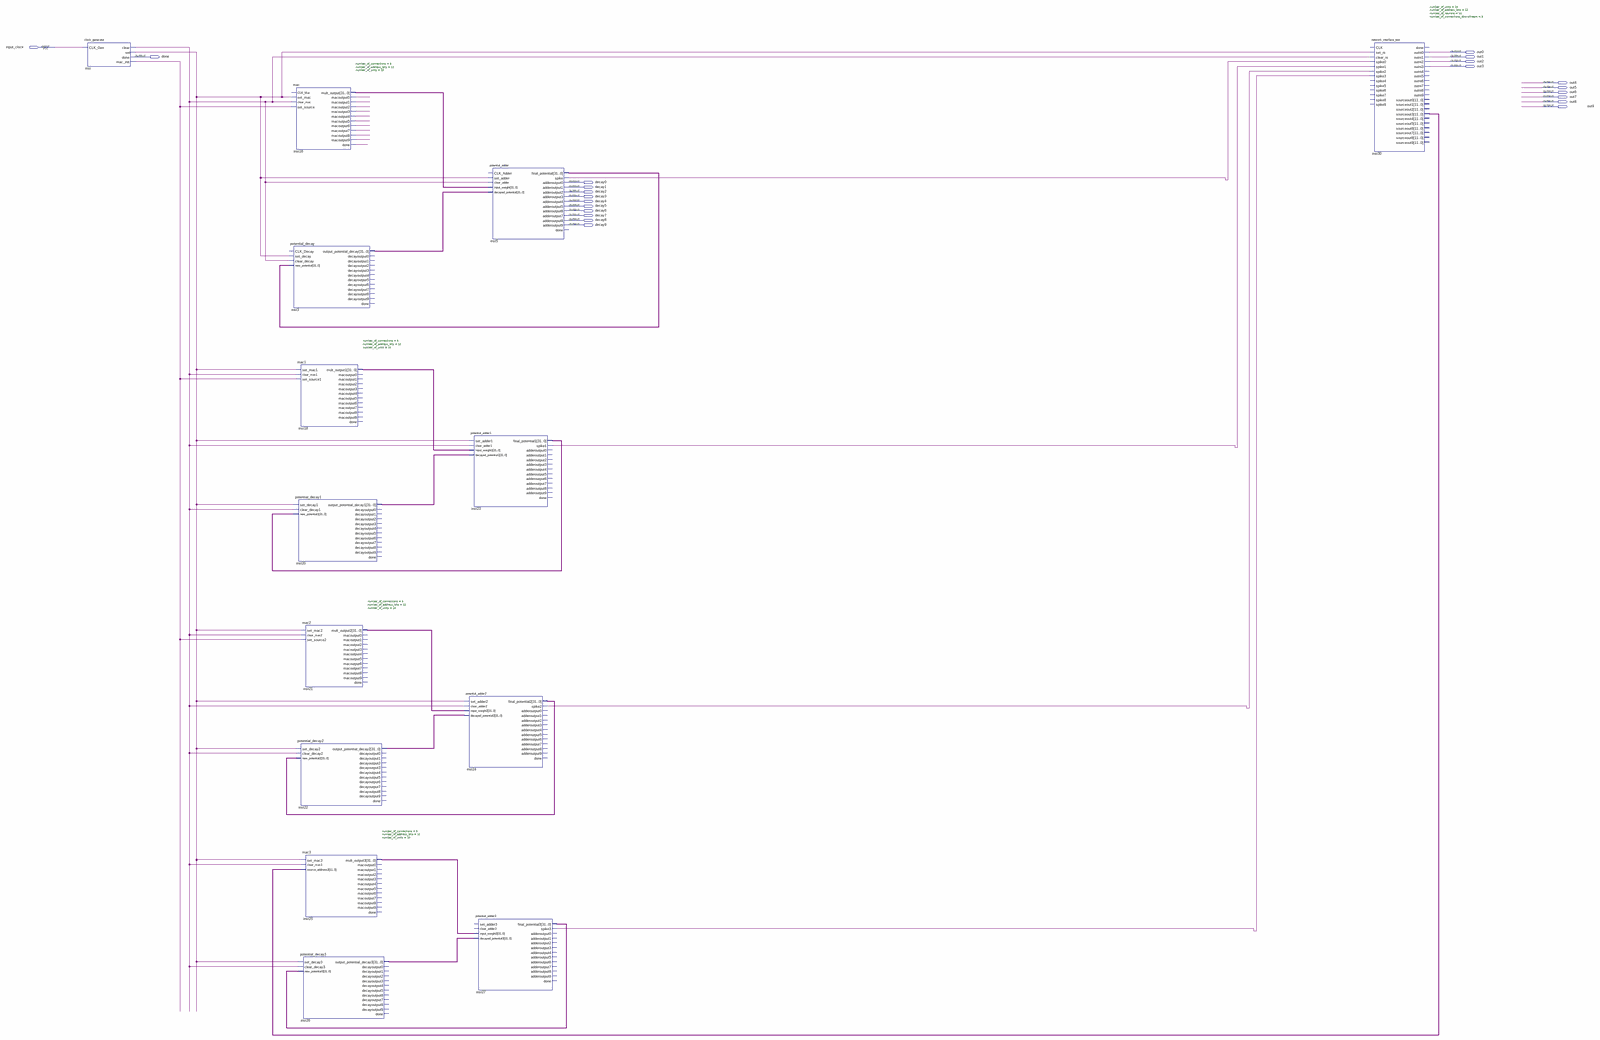
[diagram p0: schematic sheet, whole]
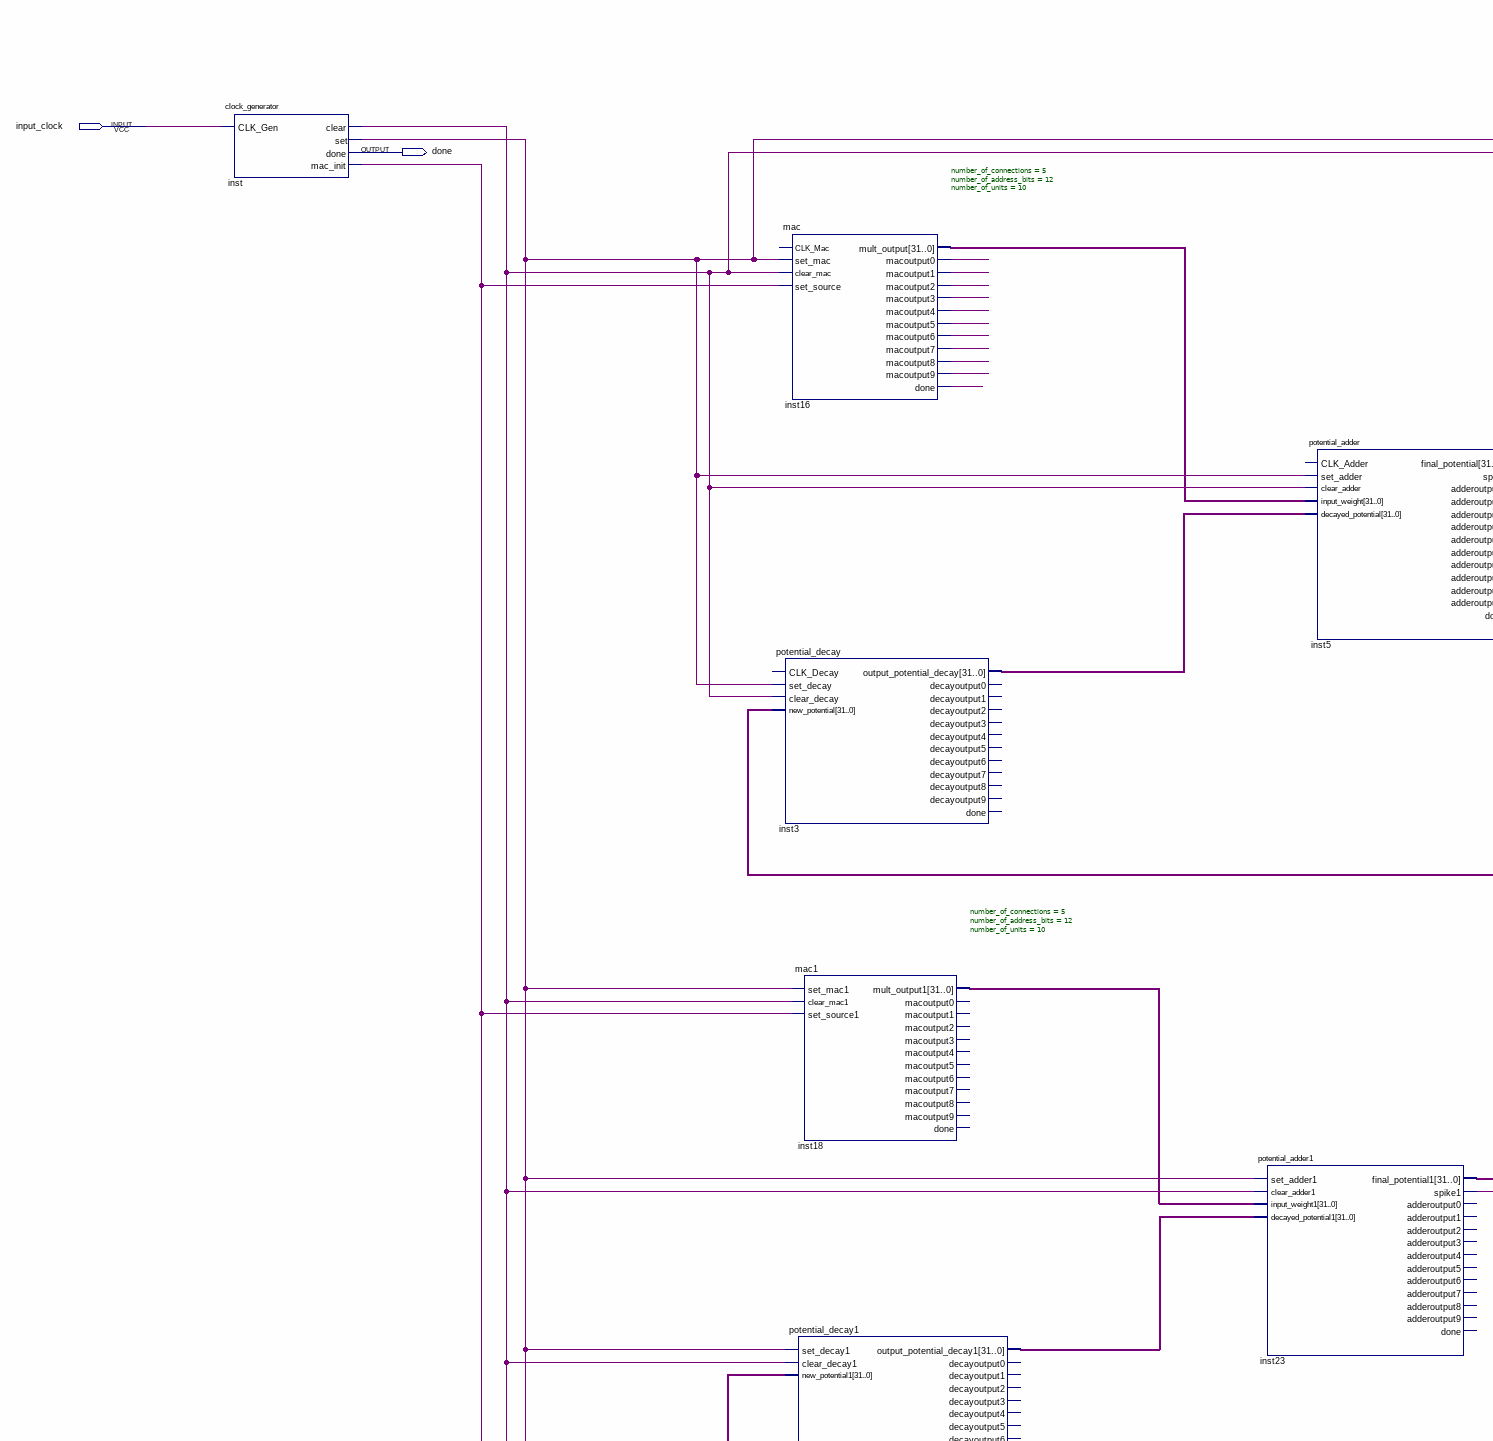
[diagram p1: schematic sheet, upper left part]
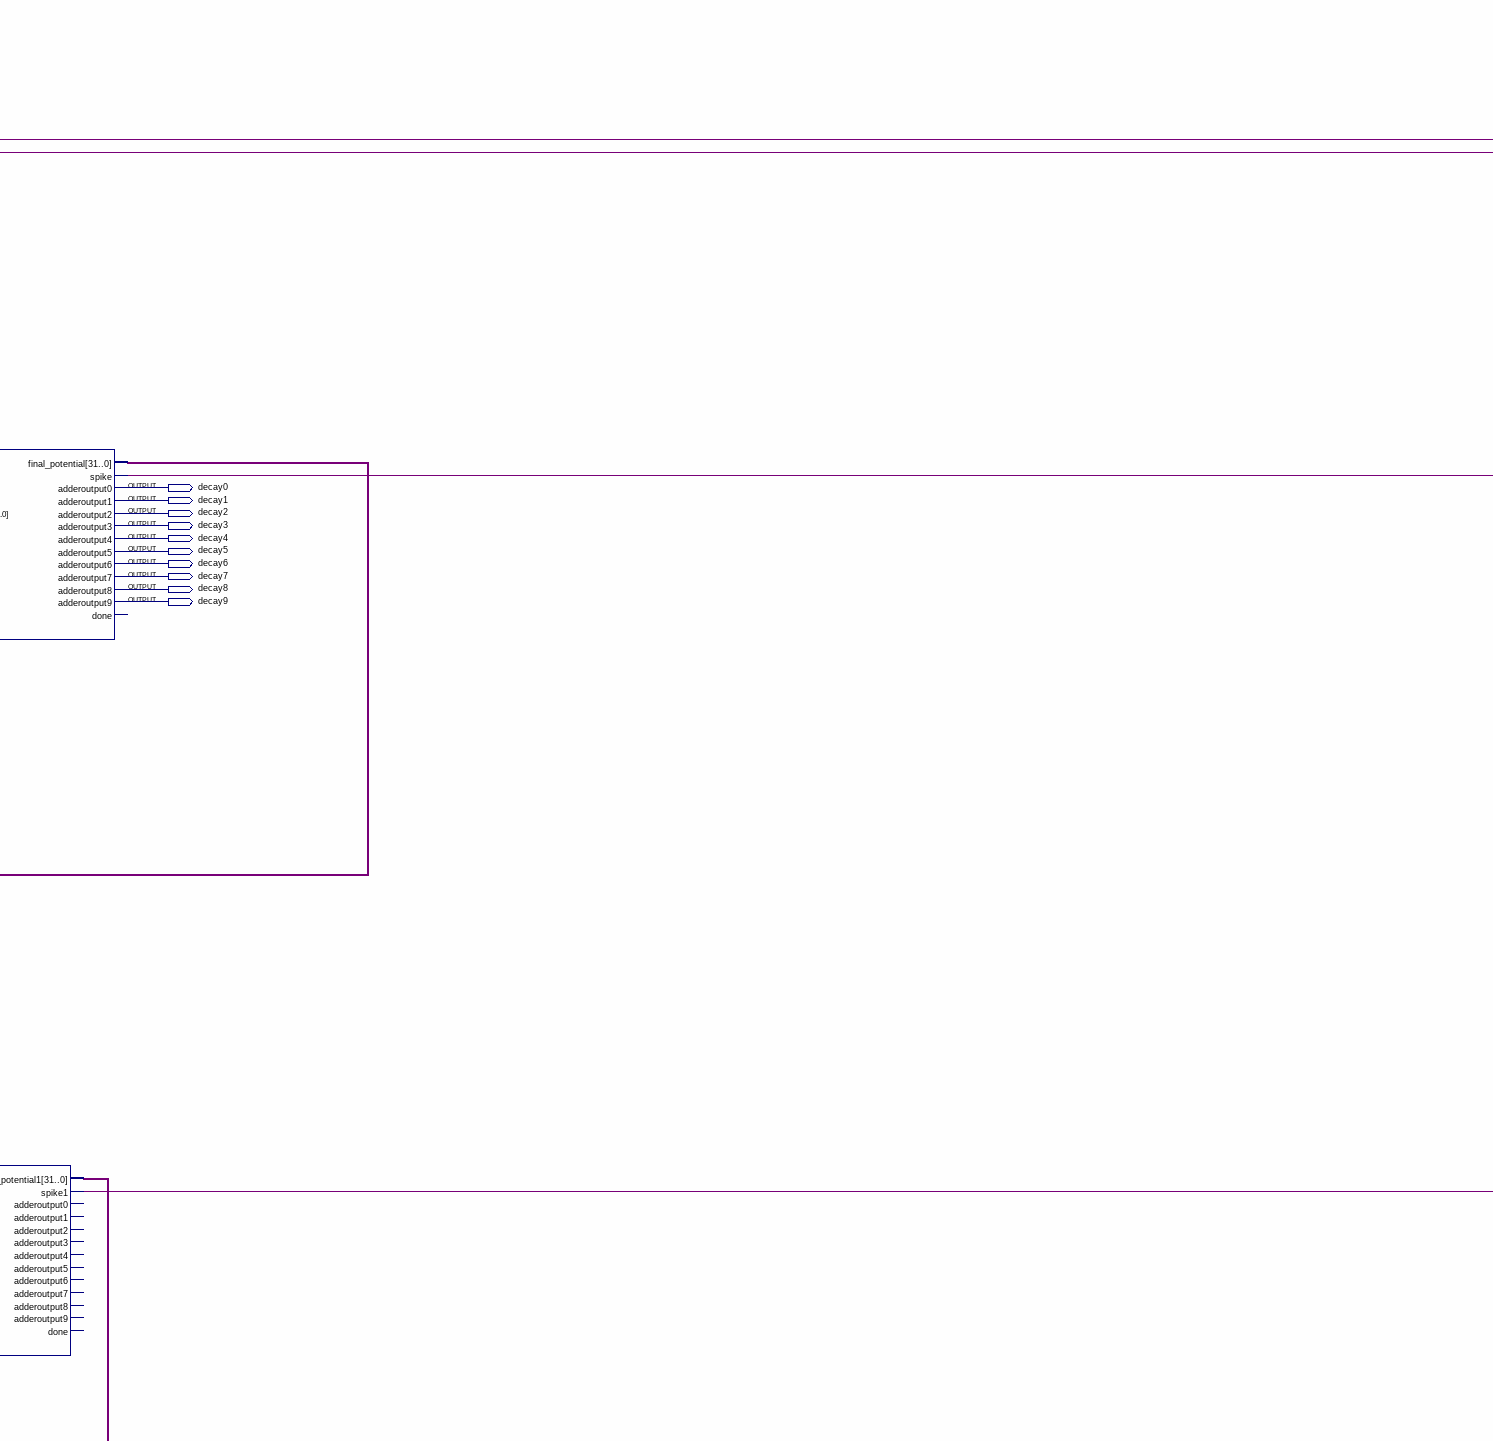
[diagram p2: schematic sheet, upper centre part]
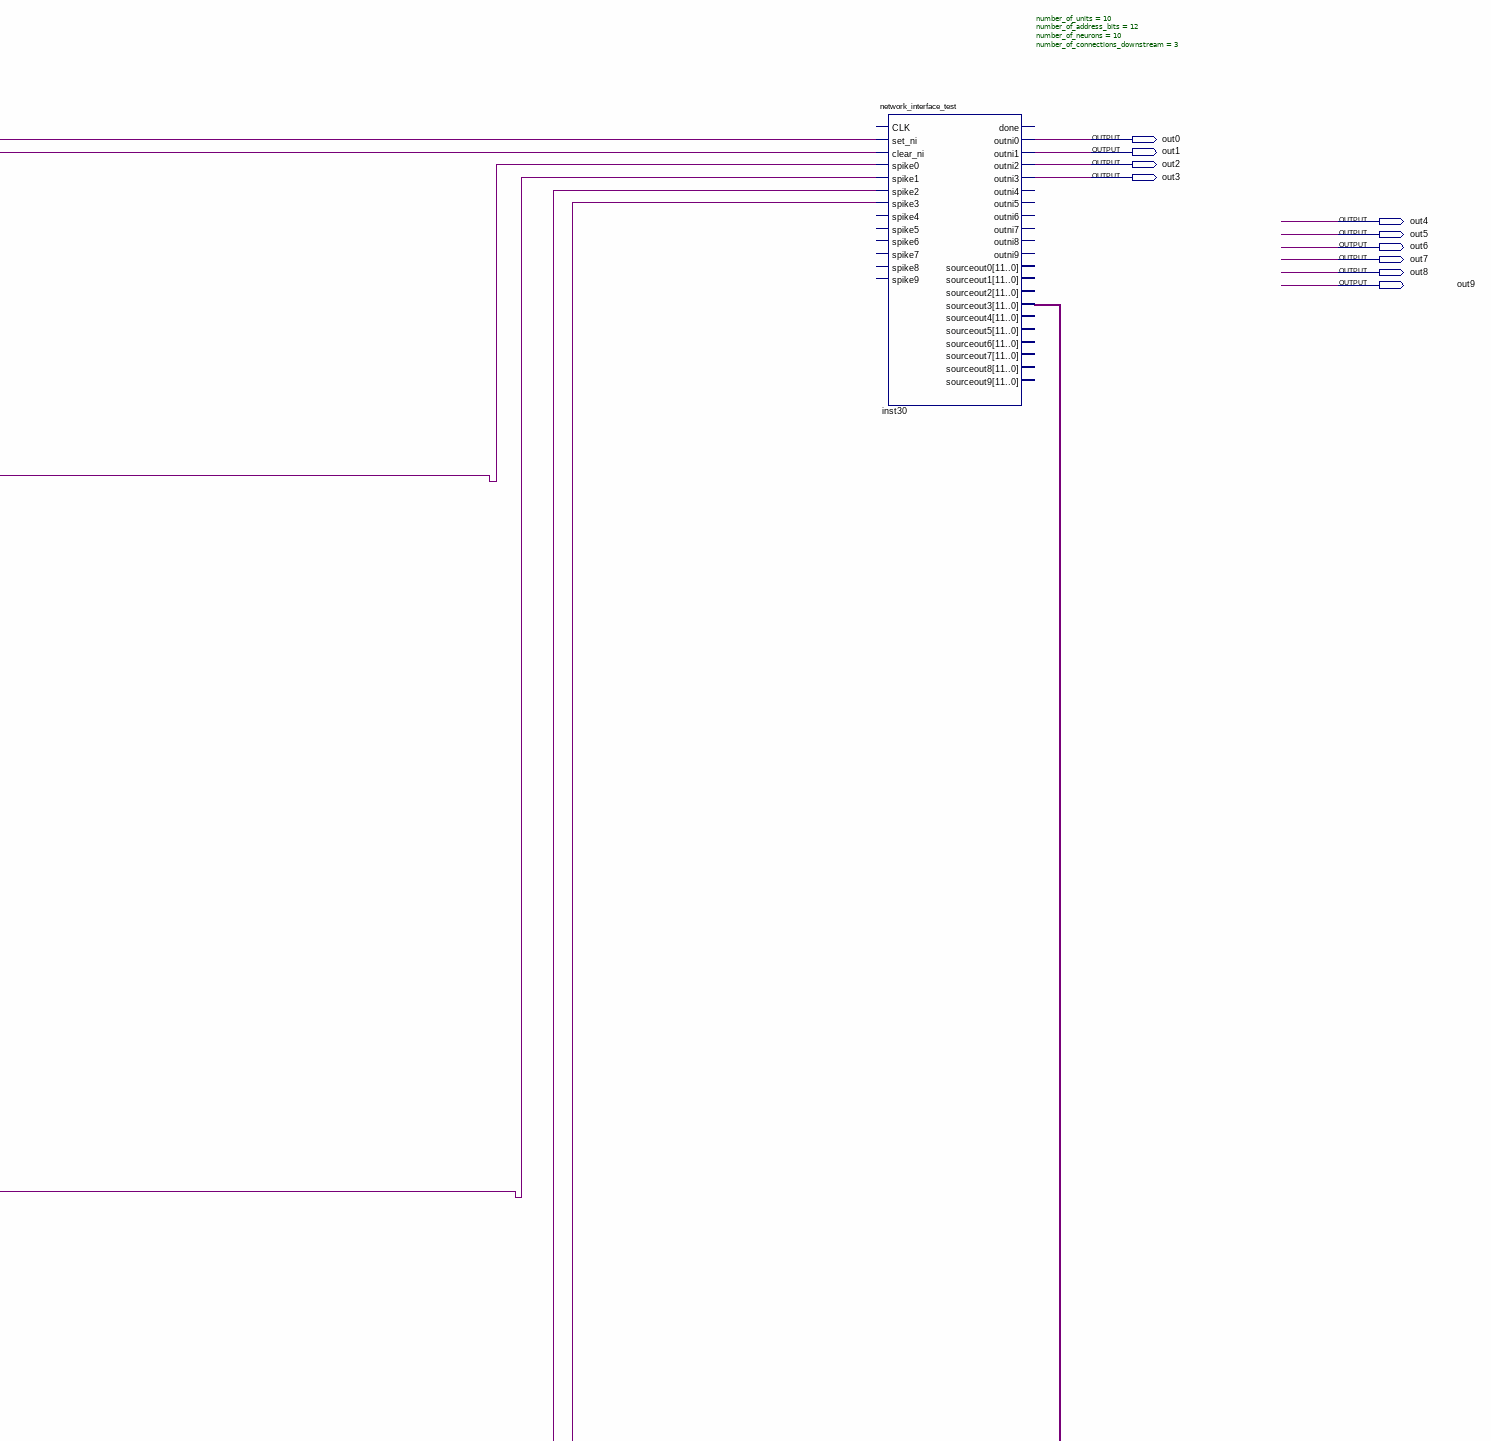
[diagram p3: schematic sheet, upper right part]
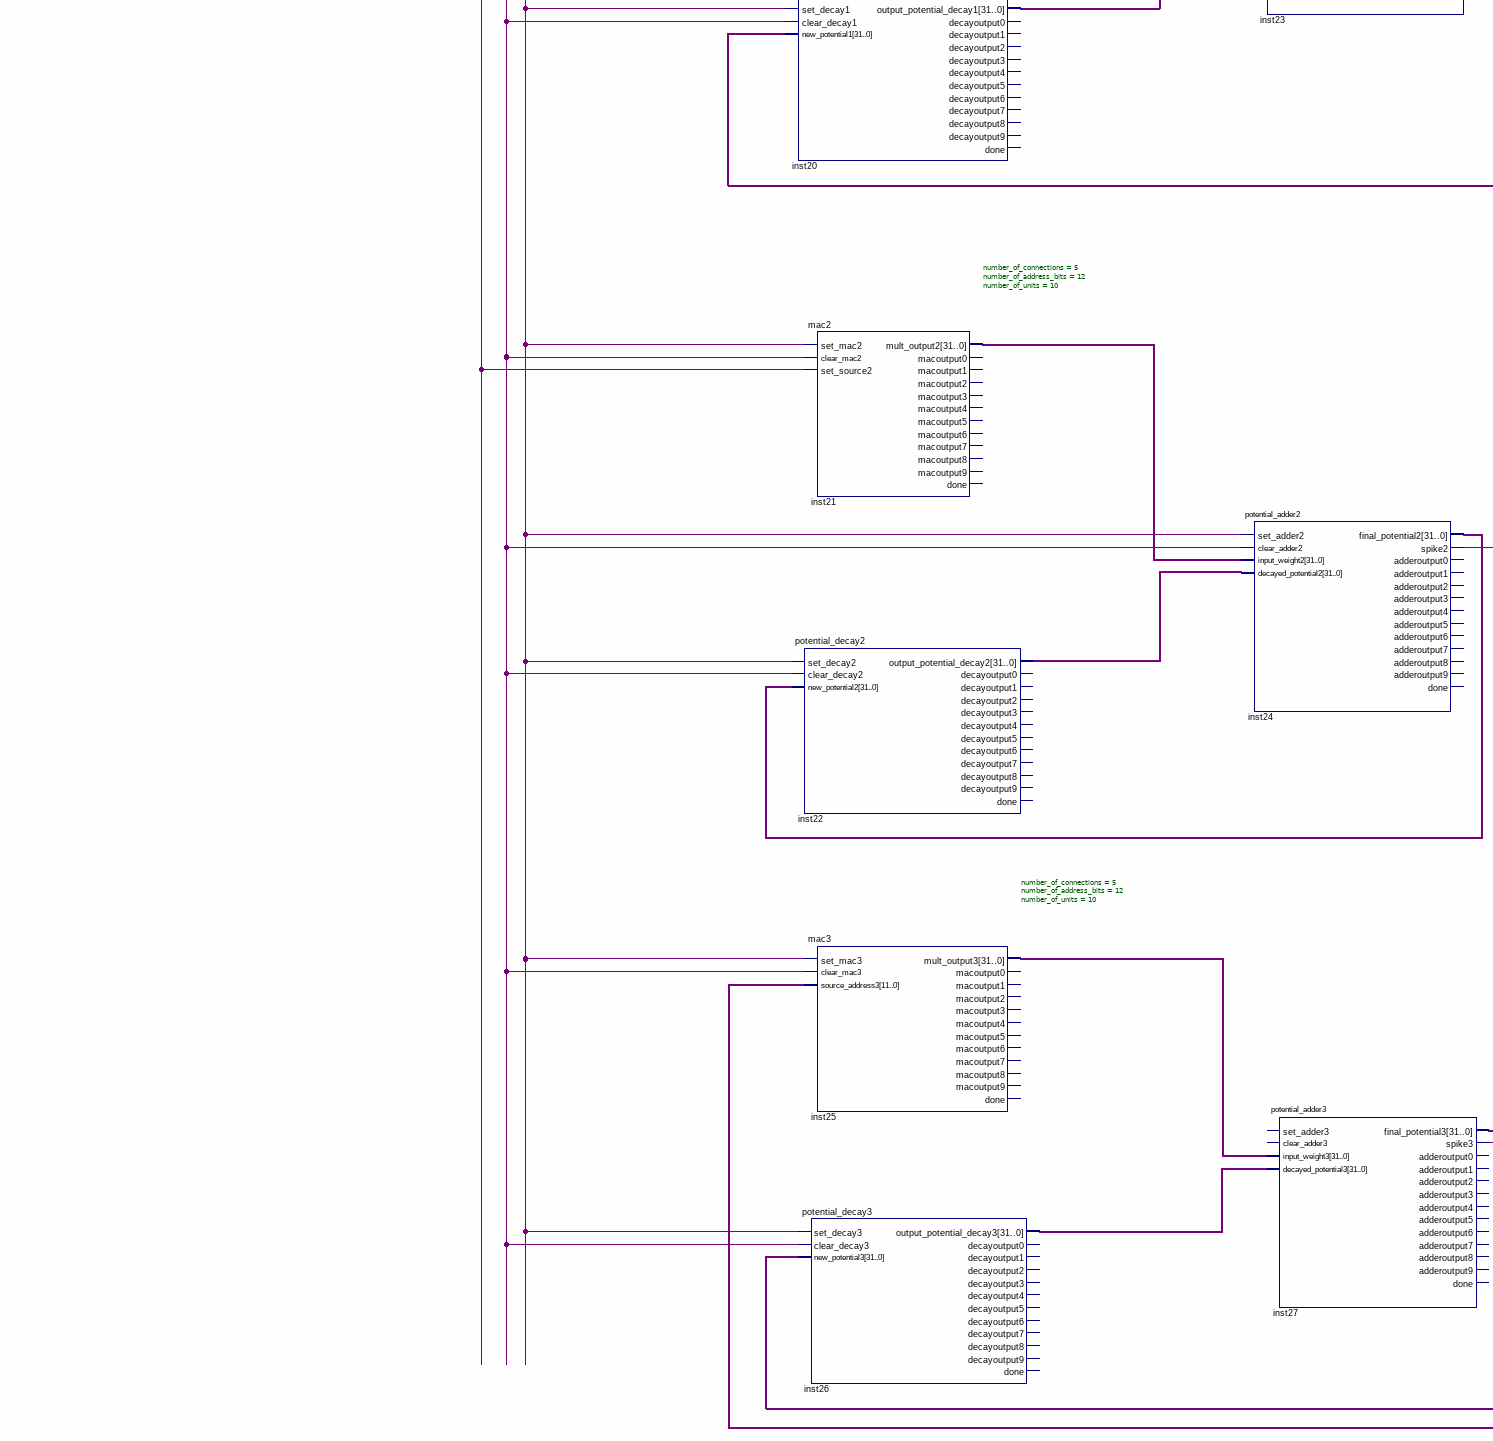
[diagram p4: schematic sheet, lower left part]
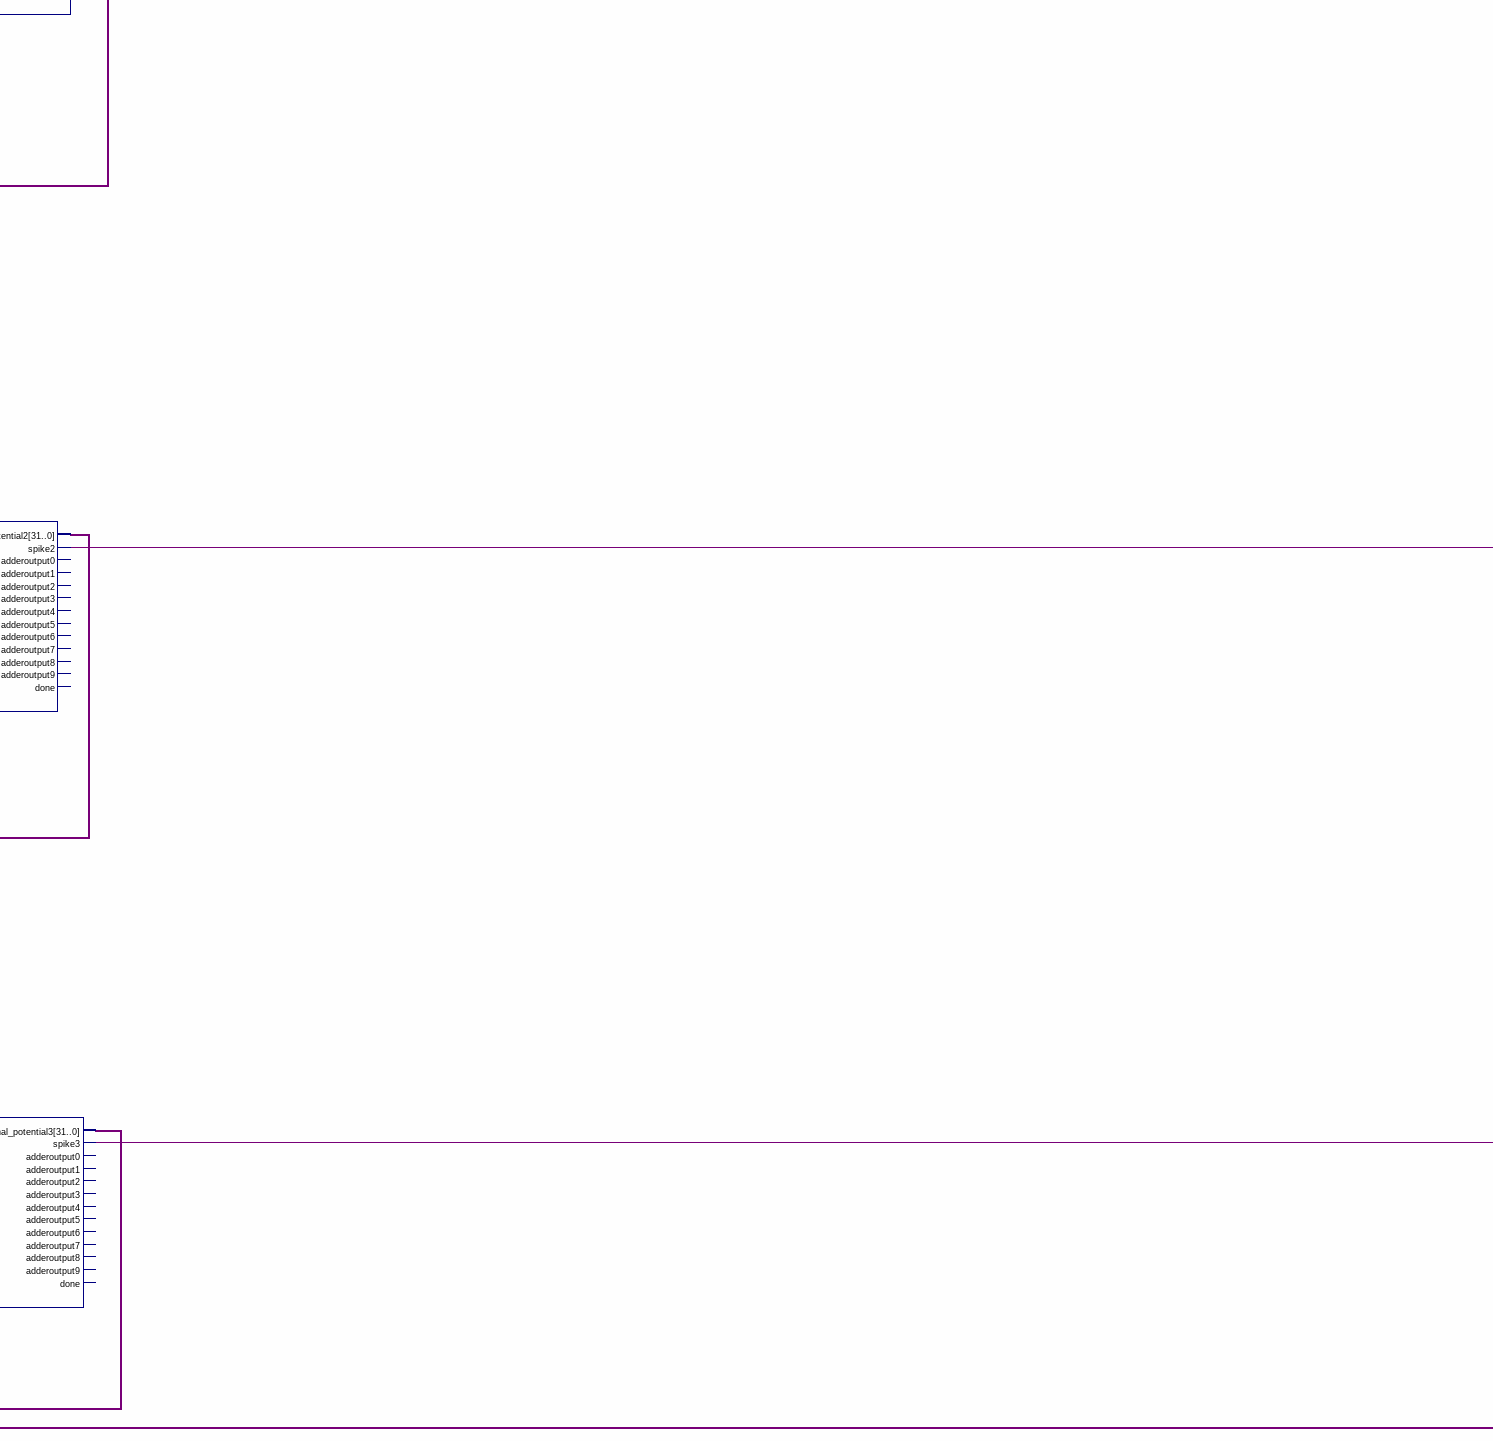
[diagram p5: schematic sheet, lower centre part]
// Quartus schematic accelerator_toplevel.bdf as structural Verilog: 14 symbols, 22 pins
module accelerator_toplevel (
  input  input_clock,
  output out0,
  output done,
  output out1,
  output out2,
  output out3,
  output out4,
  output out5,
  output out6,
  output out7,
  output out8,
  output out9,
  output decay0,
  output decay1,
  output decay2,
  output decay3,
  output decay4,
  output decay5,
  output decay6,
  output decay7,
  output decay8,
  output decay9
);

  wire inst5_spike, inst16_done, inst16_macoutput0, inst16_macoutput1, inst16_macoutput2, inst16_macoutput3,
       inst16_macoutput4, inst16_macoutput5, inst16_macoutput6, inst16_macoutput7, inst16_macoutput8,
       inst16_macoutput9, inst23_spike1, inst24_spike2, inst27_spike3, inst_clear, inst_mac_init, inst_set;
  wire [11:0] inst30_sourceout3;
  wire [31:0] inst3_output_potential_decay, inst5_final_potential, inst16_mult_output, inst18_mult_output1,
       inst20_output_potential_decay1, inst21_mult_output2, inst22_output_potential_decay2,
       inst23_final_potential1, inst24_final_potential2, inst25_mult_output3, inst26_output_potential_decay3,
       inst27_final_potential3;

  clock_generator inst (
    .CLK_Gen(input_clock), .clear(inst_clear), .set(inst_set), .done(done), .mac_init(inst_mac_init));
  mac #(.number_of_connections(5), .number_of_address_bits(12), .number_of_units(10)) inst16 (
    .set_mac(inst_set), .clear_mac(inst_clear), .set_source(inst_mac_init), .mult_output(inst16_mult_output),
    .macoutput0(inst16_macoutput0), .macoutput1(inst16_macoutput1), .macoutput2(inst16_macoutput2),
    .macoutput3(inst16_macoutput3), .macoutput4(inst16_macoutput4), .macoutput5(inst16_macoutput5),
    .macoutput6(inst16_macoutput6), .macoutput7(inst16_macoutput7), .macoutput8(inst16_macoutput8),
    .macoutput9(inst16_macoutput9), .done(inst16_done));  // open: CLK_Mac
  potential_decay inst3 (
    .set_decay(inst_set), .clear_decay(inst_clear), .new_potential(inst5_final_potential),
    .output_potential_decay(inst3_output_potential_decay));  // open: CLK_Decay, decayoutput0, decayoutput1, decayoutput2, decayoutput3, decayoutput4, decayoutput5, decayoutput6, decayoutput7, decayoutput8, decayoutput9, done
  mac1 #(.number_of_connections(5), .number_of_address_bits(12), .number_of_units(10)) inst18 (
    .set_mac1(inst_set), .clear_mac1(inst_clear), .set_source1(inst_mac_init),
    .mult_output1(inst18_mult_output1));  // open: macoutput0, macoutput1, macoutput2, macoutput3, macoutput4, macoutput5, macoutput6, macoutput7, macoutput8, macoutput9, done
  potential_decay1 inst20 (
    .set_decay1(inst_set), .clear_decay1(inst_clear), .new_potential1(inst23_final_potential1),
    .output_potential_decay1(inst20_output_potential_decay1));  // open: decayoutput0, decayoutput1, decayoutput2, decayoutput3, decayoutput4, decayoutput5, decayoutput6, decayoutput7, decayoutput8, decayoutput9, done
  mac2 #(.number_of_connections(5), .number_of_address_bits(12), .number_of_units(10)) inst21 (
    .set_mac2(inst_set), .clear_mac2(inst_clear), .set_source2(inst_mac_init),
    .mult_output2(inst21_mult_output2));  // open: macoutput0, macoutput1, macoutput2, macoutput3, macoutput4, macoutput5, macoutput6, macoutput7, macoutput8, macoutput9, done
  potential_decay2 inst22 (
    .set_decay2(inst_set), .clear_decay2(inst_clear), .new_potential2(inst24_final_potential2),
    .output_potential_decay2(inst22_output_potential_decay2));  // open: decayoutput0, decayoutput1, decayoutput2, decayoutput3, decayoutput4, decayoutput5, decayoutput6, decayoutput7, decayoutput8, decayoutput9, done
  mac3 #(.number_of_connections(5), .number_of_address_bits(12), .number_of_units(10)) inst25 (
    .set_mac3(inst_set), .clear_mac3(inst_clear), .source_address3(inst30_sourceout3),
    .mult_output3(inst25_mult_output3));  // open: macoutput0, macoutput1, macoutput2, macoutput3, macoutput4, macoutput5, macoutput6, macoutput7, macoutput8, macoutput9, done
  potential_decay3 inst26 (
    .set_decay3(inst_set), .clear_decay3(inst_clear), .new_potential3(inst27_final_potential3),
    .output_potential_decay3(inst26_output_potential_decay3));  // open: decayoutput0, decayoutput1, decayoutput2, decayoutput3, decayoutput4, decayoutput5, decayoutput6, decayoutput7, decayoutput8, decayoutput9, done
  potential_adder1 inst23 (
    .set_adder1(inst_set), .clear_adder1(inst_clear), .input_weight1(inst18_mult_output1),
    .decayed_potential1(inst20_output_potential_decay1), .final_potential1(inst23_final_potential1),
    .spike1(inst23_spike1));  // open: adderoutput0, adderoutput1, adderoutput2, adderoutput3, adderoutput4, adderoutput5, adderoutput6, adderoutput7, adderoutput8, adderoutput9, done
  potential_adder2 inst24 (
    .set_adder2(inst_set), .clear_adder2(inst_clear), .input_weight2(inst21_mult_output2),
    .decayed_potential2(inst22_output_potential_decay2), .final_potential2(inst24_final_potential2),
    .spike2(inst24_spike2));  // open: adderoutput0, adderoutput1, adderoutput2, adderoutput3, adderoutput4, adderoutput5, adderoutput6, adderoutput7, adderoutput8, adderoutput9, done
  potential_adder3 inst27 (
    .input_weight3(inst25_mult_output3), .decayed_potential3(inst26_output_potential_decay3),
    .final_potential3(inst27_final_potential3), .spike3(inst27_spike3));  // open: set_adder3, clear_adder3, adderoutput0, adderoutput1, adderoutput2, adderoutput3, adderoutput4, adderoutput5, adderoutput6, adderoutput7, adderoutput8, adderoutput9, done
  potential_adder inst5 (
    .set_adder(inst_set), .clear_adder(inst_clear), .input_weight(inst16_mult_output),
    .decayed_potential(inst3_output_potential_decay), .final_potential(inst5_final_potential),
    .spike(inst5_spike), .adderoutput0(decay0), .adderoutput1(decay1), .adderoutput2(decay2),
    .adderoutput3(decay3), .adderoutput4(decay4), .adderoutput5(decay5), .adderoutput6(decay6),
    .adderoutput7(decay7), .adderoutput8(decay8), .adderoutput9(decay9));  // open: CLK_Adder, done
  network_interface_test #(.number_of_units(10), .number_of_address_bits(12), .number_of_neurons(10), .number_of_connections_downstream(3)) inst30 (
    .set_ni(inst_set), .clear_ni(inst_clear), .spike0(inst5_spike), .spike1(inst23_spike1),
    .spike2(inst24_spike2), .spike3(inst27_spike3), .outni0(out0), .outni1(out1), .outni2(out2),
    .outni3(out3), .sourceout3(inst30_sourceout3));  // open: CLK, spike4, spike5, spike6, spike7, spike8, spike9, done, outni4, outni5, outni6, outni7, outni8, outni9, sourceout0, sourceout1, sourceout2, sourceout4, sourceout5, sourceout6, sourceout7, sourceout8, sourceout9
endmodule
